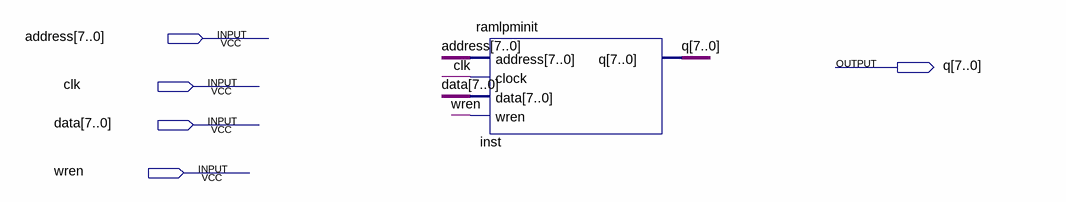
[diagram p0: schematic sheet]
// Quartus schematic lab6_ramlpminit_tb.bdf as structural Verilog: 1 symbols, 5 pins
module lab6_ramlpminit_tb (
  input  [7:0] address,
  input  clk,
  input  [7:0] data,
  input  wren,
  output [7:0] q
);

  ramlpminit inst (.address(address), .clock(clk), .data(data), .wren(wren), .q(q));
endmodule
